# Altium project AdvancedSeq.PrjPcb
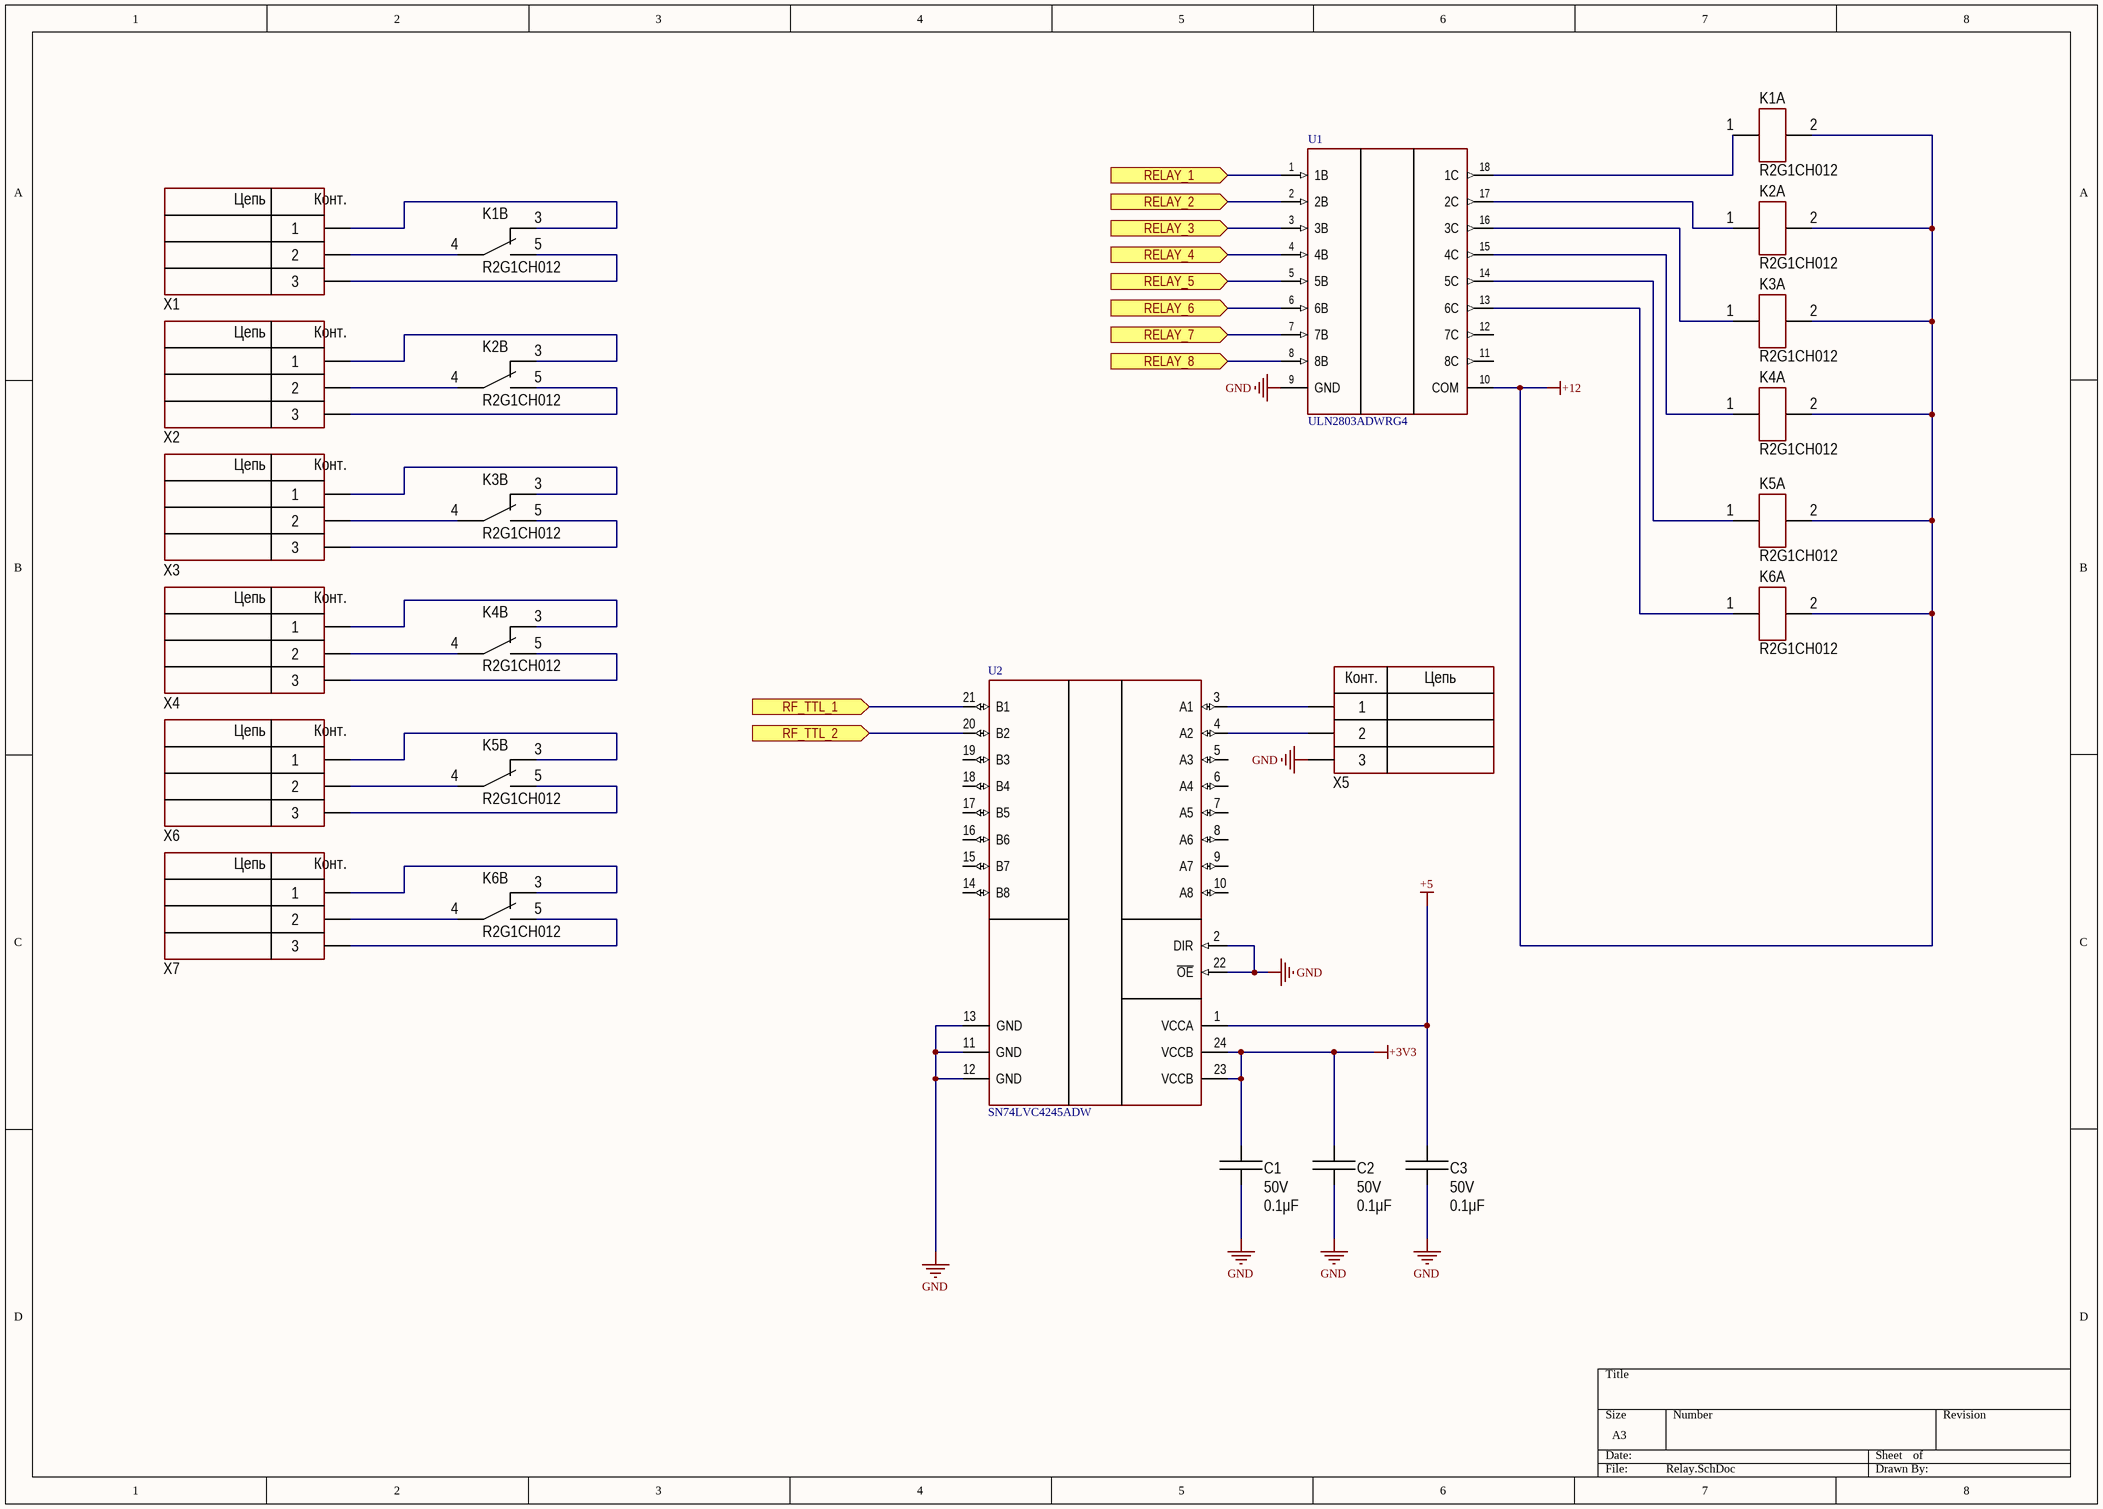
[diagram p0: Relay.SchDoc]
6 sheets, 93 parts. Net scope: flat (ports and power ports of the same name join across sheets).
Board file: Seq.PcbDoc
Sheets:
  Relay.SchDoc
  MCU.SchDoc
  Ext_PTT_and_Indication.SchDoc
  Power_Supply.SchDoc
  JTAG_Connector.SchDoc
  Shift_Regs.SchDoc

## Sheet Relay.SchDoc
size A3; SheetNumber: 1; SheetTotal: 2

### Parts
C1  value 0.1μF  Voltage: 50V  [CAP: 1206]
C2  value 0.1μF  Voltage: 50V  [CAP: 1206]
C3  value 0.1μF  Voltage: 50V  [CAP: 1206]
K1  (no value)  [R2G1CH012]  (parts A,B of 2)
K2  (no value)  [R2G1CH012]  (parts A,B of 2)
K3  (no value)  [R2G1CH012]  (parts A,B of 2)
K4  (no value)  [R2G1CH012]  (parts A,B of 2)
K5  (no value)  [R2G1CH012]  (parts A,B of 2)
K6  (no value)  [R2G1CH012]  (parts A,B of 2)
U1  ULN2803ADWRG4  [FP-DW0018A-MFG]
U2  SN74LVC4245ADW  [FP-DW0024A-MFG]
X1  (no value)  [2EDGR-5.08-03P]
X2  (no value)  [2EDGR-5.08-03P]
X3  (no value)  [2EDGR-5.08-03P]
X4  (no value)  [2EDGR-5.08-03P]
X5  (no value)  [2EDGR-5.08-03P]
X6  (no value)  [2EDGR-5.08-03P]
X7  (no value)  [2EDGR-5.08-03P]

### Ports
RELAY_1 (in), RELAY_2 (in), RELAY_3 (in), RELAY_4 (in), RELAY_5 (in), RELAY_6 (in), RELAY_7 (in), RELAY_8 (in), RF_TTL_1 (in), RF_TTL_2 (in)

### Nets
+3V3: C1.2 C2.2 U2.23(VCCB) U2.24(VCCB)
+5: C3.2 U2.1(VCCA)
+12: K1.2 K2.2 K3.2 K4.2 K5.2 K6.2 U1.10(COM)
GND: C1.1 C2.1 C3.1 U1.9(GND) U2.2(DIR) U2.11(GND) U2.12(GND) U2.22(~{OE}) X5.3
NetK1_1: K1.1 U1.18(1C)
NetK1_3: K1.3 X1.1
NetK1_4: K1.4 X1.2
NetK1_5: K1.5 X1.3
NetK2_1: K2.1 U1.17(2C)
NetK2_3: K2.3 X2.1
NetK2_4: K2.4 X2.2
NetK2_5: K2.5 X2.3
NetK3_1: K3.1 U1.16(3C)
NetK3_3: K3.3 X3.1
NetK3_4: K3.4 X3.2
NetK3_5: K3.5 X3.3
NetK4_1: K4.1 U1.15(4C)
NetK4_3: K4.3 X4.1
NetK4_4: K4.4 X4.2
NetK4_5: K4.5 X4.3
NetK5_1: K5.1 U1.14(5C)
NetK5_3: K5.3 X6.1
NetK5_4: K5.4 X6.2
NetK5_5: K5.5 X6.3
NetK6_1: K6.1 U1.13(6C)
NetK6_3: K6.3 X7.1
NetK6_4: K6.4 X7.2
NetK6_5: K6.5 X7.3
NetU1_1: U1.1(1B) ; port RELAY_1
NetU1_2: U1.2(2B) ; port RELAY_2
NetU1_3: U1.3(3B) ; port RELAY_3
NetU1_4: U1.4(4B) ; port RELAY_4
NetU1_5: U1.5(5B) ; port RELAY_5
NetU1_6: U1.6(6B) ; port RELAY_6
NetU1_7: U1.7(7B) ; port RELAY_7
NetU1_8: U1.8(8B) ; port RELAY_8
NetU2_3: U2.3(A1) X5.1
NetU2_4: U2.4(A2) X5.2
NetU2_20: U2.20(B2) ; port RF_TTL_2
NetU2_21: U2.21(B1) ; port RF_TTL_1

Not connected (* = marked no-connect by the designer): U1 11(8C) 12(7C); U2 5(A3) 6(A4) 7(A5) 8(A6) 9(A7) 10(A8) 13(GND) 14(B8) 15(B7) 16(B6) 17(B5) 18(B4) 19(B3)

### Notes on the sheet
- (in symbol 2EDGR-5.08-03P) Цепь; Конт.

### Library data of the parts
C1-C3 = Ceramic_1206: Manufacturer: Yageo; PartNumber: CC1206KRX7R9BB104; ValueManufacturerPartNumber: Ceramic capacitor, 0.1μF, X7R, ±10%, 50V, 1206, -55...+125°C; TypeCapacitor: Ceramic capacitor; Tolerance: ±10%; TypeDielectric: X7R; Package: 1206; HelpURL: https://www.digikey.com/product-detail/en/yageo/CC1206KRX7R9BB104/311-1179-1-ND/303089; Temperature: -55...+125°C
K1-K6 = R2G1CH012: Manufacturer: Omron; ValueManufacturerPartNumber: Electromechanics relay, 3VDC, 125VAC, 2A, 2NO+2NC, -40...+85°C; TypeRelay: Electromechanics relay; VoltageMax: 125VAC; VoltageControlCoil: 3VDC; MaxCurrent: 2A; Package: 2NO+2NC; HelpURL: https://www.digikey.com/product-detail/en/omron-electronics-inc-emc-div/G5V-2-DC3/Z2185-ND/369042; Temperature: -40...+85°C; PartNumber: R2G1CH012
U1 = CMP-04912-000023-1: TRANS 8NPN DARL 50V 0.5A 18SO; Manufacturer: Texas Instruments; Number Of Drivers: 8; Max Junction Temp: +150°C; Standoff Height: 0.1mm; Turn On Delay Time: 20ns; Nominal Supply Current: 0.93mA; Turn Off Delay Time: 130ns; Output Current: 500mA; Manufacturer Part Number: ULN2803ADWRG4; Mouser Description: Darlington Transistors TRANSISTOR ARRAYS; Temperature Range High: +85°C; Ipc Land Pattern Name: SOIC127P1030X265-18; RoHS: TRUE; ComponentLink2URL: http://www.ti.com/lit/ds/symlink/uln2803a.pdf; Device Class L2: Power Management ICs; Output Voltage: 50V; Digikey Description: TRANS 8NPN DARL 50V 0.5A 18SO; Package: DW0018A; Device Class L3: Gate Drivers; Octopart: https://octopart.com/uln2803adwrg4-texas+instruments-2343640; ComponentLink2Description: Datasheet; Ambient Temperature Range High: +85°C; Lead Free: Yes; Device Class L1: Integrated Circuits (ICs); Height: 2.65mm; Category: IC; Automotive: No; Temperature: -40°C to +85°C; Temperature Range Low: -40°C; Ambient Temperature Range Low: -40°C; Number Of Outputs: 8
U2 = CMP-04899-000091-1: IC TRNSLTR BIDIRECTIONAL 24SOIC; Number of Bits: 8; Low Level Output Current: 24mA; Output Type: Voltage; Propagation Delay: 9.8ns; Min Supply Voltage: 4.5V; Number of Elements: 1; Turn-On Delay Time: 6.7ns; Max Supply Current: 80uA; Max Supply Voltage: 5.5V; Polarity: Non-Inverting; Logic Function: Translator; Operating Supply Voltage: 5V; High Level Output Current: -24mA; Case/Package: SOIC; Height: 2.35mm; Width: 7.52mm; Number of Pins: 24; Weight: 0.022025oz; Lead Free: Lead Free; Packaging: Rail/Tube; Number of Channels: 8; Series: 74LVC; REACH SVHC: No SVHC; RoHS Compliant: Yes; Mount: Surface Mount; Length: 15.4mm; Package Quantity: 25; Radiation Hardening: No; Contact Plating: Gold; Quiescent Current: 80uA; Max Operating Temperature: 85°C; Direction: Bidirectional; Number of Outputs: 8; Technology: CMOS; Min Operating Temperature: -40°C; Number of Circuits: 8
X1-X7 = 2EDGR-5.08-03P: Manufacturer: Connfly; ValueManufacturerPartNumber: Connector, 6pin, 2.54mm, 500VAC, 3A; PartNumber: PBS-6; TypeConnector: Connector; VoltageMax: 500VAC; Pitch: 2.54mm; CurrentMax: 3A; Multichannel: 6pin; CommentText: "Разъем"; HelpURL: https://www.chipdip.ru/product/pbs-6

## Sheet MCU.SchDoc
size A2; SheetNumber: 2; SheetTotal: 2
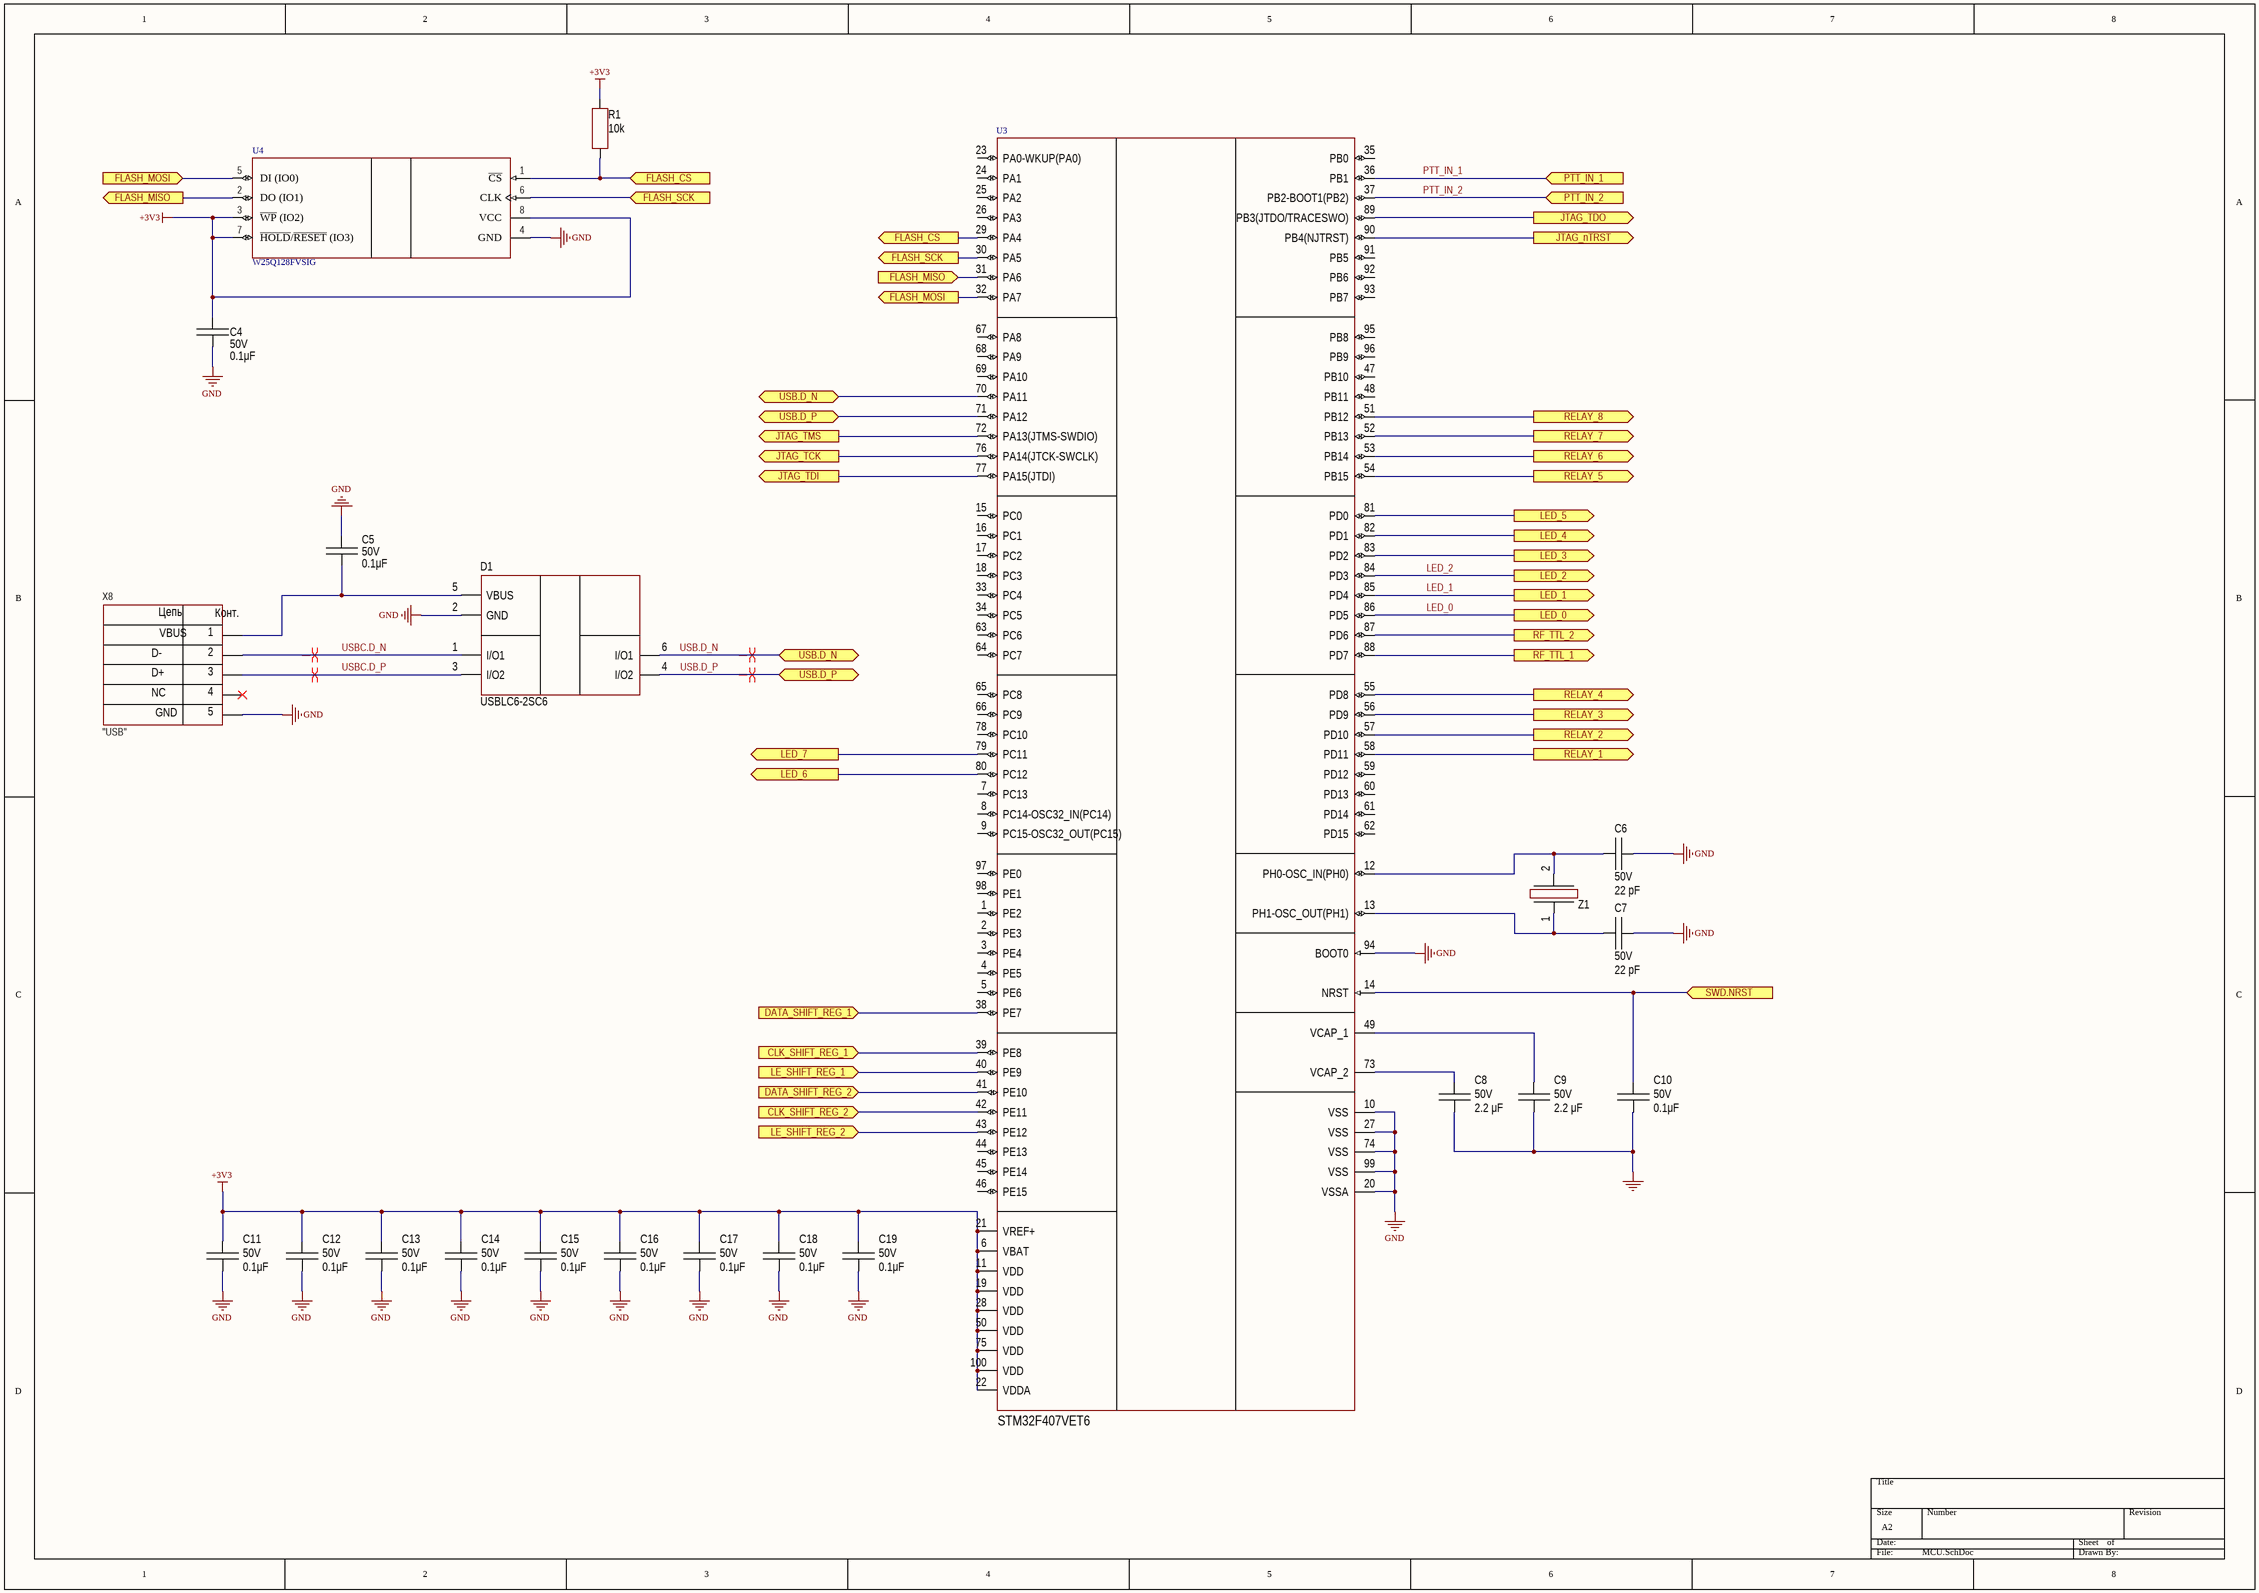
[diagram p1: MCU.SchDoc]

### Parts
C4  value 0.1μF  Voltage: 50V  [CAP: 1206]
C5  value 0.1μF  Voltage: 50V  [CAP: 1206]
C6  value 22 pF  Voltage: 50V  [CAP: 1206]
C7  value 22 pF  Voltage: 50V  [CAP: 1206]
C8  value 2.2 μF  Voltage: 50V  [CAP: 1206]
C9  value 2.2 μF  Voltage: 50V  [CAP: 1206]
C10  value 0.1μF  Voltage: 50V  [CAP: 1206]
C11  value 0.1μF  Voltage: 50V  [CAP: 1206]
C12  value 0.1μF  Voltage: 50V  [CAP: 1206]
C13  value 0.1μF  Voltage: 50V  [CAP: 1206]
C14  value 0.1μF  Voltage: 50V  [CAP: 1206]
C15  value 0.1μF  Voltage: 50V  [CAP: 1206]
C16  value 0.1μF  Voltage: 50V  [CAP: 1206]
C17  value 0.1μF  Voltage: 50V  [CAP: 1206]
C18  value 0.1μF  Voltage: 50V  [CAP: 1206]
C19  value 0.1μF  Voltage: 50V  [CAP: 1206]
D1  (no value)  [SOT23-6]
R1  value 10k  [RES: 1206]
U3  STM32F407VET6  [STM-LQFP100_V]
U4  W25Q128FVSIG  [8-SOIC]
X8  CommentText: "USB"  [CON: 0675031020]
Z1  (no value)  [CTS-ATS-SM-XTAL-2]

### Ports
CLK_SHIFT_REG_1 (in), CLK_SHIFT_REG_2 (in), DATA_SHIFT_REG_1 (in), DATA_SHIFT_REG_2 (in), FLASH_CS (in), FLASH_CS (out), FLASH_MISO (in), FLASH_MISO (out), FLASH_MOSI (in), FLASH_MOSI (out), FLASH_SCK (in), FLASH_SCK (out), JTAG_nTRST (out), JTAG_TCK (out), JTAG_TDI (out), JTAG_TDO (out), JTAG_TMS (out), LE_SHIFT_REG_1 (in), LE_SHIFT_REG_2 (in), LED_0 (out), LED_1 (out), LED_2 (out), LED_3 (out), LED_4 (out), LED_5 (out), LED_6 (out), LED_7 (out), PTT_IN_1 (in), PTT_IN_2 (in), RELAY_1 (out), RELAY_2 (out), RELAY_3 (out), RELAY_4 (out), RELAY_5 (out), RELAY_6 (out), RELAY_7 (out), RELAY_8 (out), RF_TTL_1 (out), RF_TTL_2 (out), SWD.NRST (in), USB.D_N (bidir), USB.D_P (bidir)

### Nets
+3V3: C4.1 C11.2 C12.2 C13.2 C14.2 C15.2 C16.2 C17.2 C18.2 C19.2 R1.1 U3.6(VBAT) U3.11(VDD) U3.19(VDD) U3.21(VREF+) U3.22(VDDA) U3.28(VDD) U3.50(VDD) U3.75(VDD) U3.100(VDD) U4.3(~{WP}_(IO2)) U4.7(~{HOLD}/~{RESET}_(IO3)) U4.8(VCC)
GND: C4.2 C5.1 C6.1 C7.1 C8.1 C9.1 C10.1 C11.1 C12.1 C13.1 C14.1 C15.1 C16.1 C17.1 C18.1 C19.1 D1.2(GND) U3.10(VSS) U3.20(VSSA) U3.27(VSS) U3.74(VSS) U3.94(BOOT0) U3.99(VSS) U4.4(GND) X8.5
JTAG_nTRST: U3.90(PB4(NJTRST)) ; port JTAG_nTRST
JTAG_TCK: U3.76(PA14(JTCK-SWCLK)) ; port JTAG_TCK
JTAG_TDI: U3.77(PA15(JTDI)) ; port JTAG_TDI
JTAG_TDO: U3.89(PB3(JTDO/TRACESWO)) ; port JTAG_TDO
JTAG_TMS: U3.72(PA13(JTMS-SWDIO)) ; port JTAG_TMS
LED_0: U3.86(PD5) ; port LED_0
LED_1: U3.85(PD4) ; port LED_1
LED_2: U3.84(PD3) ; port LED_2
PTT_IN_1: U3.36(PB1) ; port PTT_IN_1
PTT_IN_2: U3.37(PB2-BOOT1(PB2)) ; port PTT_IN_2
SWD.NRST: C10.2 U3.14(NRST) ; port SWD.NRST
USB.D_N: D1.6(I/O1) U3.70(PA11) ; port USB.D_N
USB.D_P: D1.4(I/O2) U3.71(PA12) ; port USB.D_P
USBC.D_N: D1.1(I/O1) X8.2
USBC.D_P: D1.3(I/O2) X8.3
NetC5_2: C5.2 D1.5(VBUS) X8.1
NetC6_2: C6.2 U3.12(PH0-OSC_IN(PH0)) Z1.2
NetC7_2: C7.2 U3.13(PH1-OSC_OUT(PH1)) Z1.1
NetC8_2: C8.2 U3.73(VCAP_2)
NetC9_2: C9.2 U3.49(VCAP_1)
NetR1_2: R1.2 U3.29(PA4) U4.1(~{CS}) ; port FLASH_CS
NetR9_1: U3.83(PD2) ; port LED_3
NetR10_1: U3.82(PD1) ; port LED_4
NetR11_1: U3.81(PD0) ; port LED_5
NetR12_1: U3.80(PC12) ; port LED_6
NetR13_1: U3.79(PC11) ; port LED_7
NetU1_1: U3.58(PD11) ; port RELAY_1
NetU1_2: U3.57(PD10) ; port RELAY_2
NetU1_3: U3.56(PD9) ; port RELAY_3
NetU1_4: U3.55(PD8) ; port RELAY_4
NetU1_5: U3.54(PB15) ; port RELAY_5
NetU1_6: U3.53(PB14) ; port RELAY_6
NetU1_7: U3.52(PB13) ; port RELAY_7
NetU1_8: U3.51(PB12) ; port RELAY_8
NetU2_20: U3.87(PD6) ; port RF_TTL_2
NetU2_21: U3.88(PD7) ; port RF_TTL_1
NetU3_30: U3.30(PA5) U4.6(CLK) ; port FLASH_SCK
NetU3_31: U3.31(PA6) U4.2(DO_(IO1)) ; port FLASH_MISO
NetU3_32: U3.32(PA7) U4.5(DI_(IO0)) ; port FLASH_MOSI
NetU3_38: U3.38(PE7) ; port DATA_SHIFT_REG_1
NetU3_39: U3.39(PE8) ; port CLK_SHIFT_REG_1
NetU3_40: U3.40(PE9) ; port LE_SHIFT_REG_1
NetU3_41: U3.41(PE10) ; port DATA_SHIFT_REG_2
NetU3_42: U3.42(PE11) ; port CLK_SHIFT_REG_2
NetU3_43: U3.43(PE12) ; port LE_SHIFT_REG_2

Not connected (* = marked no-connect by the designer): U3 1(PE2) 2(PE3) 3(PE4) 4(PE5) 5(PE6) 7(PC13) 8(PC14-OSC32_IN(PC14)) 9(PC15-OSC32_OUT(PC15)) 15(PC0) 16(PC1) 17(PC2) 18(PC3) 23(PA0-WKUP(PA0)) 24(PA1) 25(PA2) 26(PA3) 33(PC4) 34(PC5) 35(PB0) 44(PE13) 45(PE14) 46(PE15) 47(PB10) 48(PB11) 59(PD12) 60(PD13) 61(PD14) 62(PD15) 63(PC6) 64(PC7) 65(PC8) 66(PC9) 67(PA8) 68(PA9) 69(PA10) 78(PC10) 91(PB5) 92(PB6) 93(PB7) 95(PB8) 96(PB9) 97(PE0) 98(PE1); X8 4*

### Layout directives
differential pair: USB.D_N, USB.D_P, USBC.D_N, USBC.D_P

### Notes on the sheet
- (in symbol Connector_USB_mini_B) Цепь; Конт.; VBUS; D-; D+; NC; GND

### Library data of the parts
C4 C5 C10-C19 = Ceramic_1206: as C1 on sheet Relay; Package: 1206; HelpURL: https://www.digikey.com/product-detail/en/yageo/CC1206KRX7R9BB104/311-1179-1-ND/303089; Temperature: -55...+125°C
C6 C7 = Ceramic_1206: Manufacturer: Yageo; PartNumber: CC1206KRX7R9BB104; ValueManufacturerPartNumber: Ceramic capacitor, 22 pF, X7R, ±10%, 50V, 1206, -55...+125°C; TypeCapacitor: Ceramic capacitor; Tolerance: ±10%; TypeDielectric: X7R; Package: 1206; HelpURL: https://www.digikey.com/product-detail/en/yageo/CC1206KRX7R9BB104/311-1179-1-ND/303089; Temperature: -55...+125°C
C8 C9 = Ceramic_1206: Manufacturer: Yageo; PartNumber: CC1206KRX7R9BB104; ValueManufacturerPartNumber: Ceramic capacitor, 2.2 μF, X7R, ±10%, 50V, 1206, -55...+125°C; TypeCapacitor: Ceramic capacitor; Tolerance: ±10%; TypeDielectric: X7R; Package: 1206; HelpURL: https://www.digikey.com/product-detail/en/yageo/CC1206KRX7R9BB104/311-1179-1-ND/303089; Temperature: -55...+125°C
D1 = USBLC6-2SC6: Manufacturer: STMicroelectronics; TypeDiode: USB protection; Current: 5A peak; VoltageDrop: 17V; RecoveryTime: Power line; Package: SOT-23-6; HelpURL: https://www.digikey.com/product-detail/en/stmicroelectronics/USBLC6-2SC6/497-5235-1-ND/1121688; ValueManufacturerPartNumber: =TypeDiode+', '+Voltage+', '+Current+', '+VoltageDrop+', '+RecoveryTime+', '+Package+', '+Temperature; Temperature: -40...+125°C; PartNumber: USBLC6-2SC6
R1 = Resistor_1206: Manufacturer: Yageo; PartNumber: RC1206JR-07100RL; TypeResistor: Resistor film; Power: 0.25W; Package: 1206; HelpURL: https://www.digikey.com/product-detail/en/yageo/RC1206JR-07100RL/311-100ERCT-ND/732153; ValueManufacturerPartNumber: =TypeResistor+', '+Value+', '+Tolerance+', '+Package+', '+Power+', '+Temperature; Temperature: -55...+125°C
U3 = CMP-0243-00016-3: ARM Cortex-M4 32-bit MCU+FPU, 210 DMIPS, 512 kB Flash, 192 kB Internal RAM, 82 I/Os, 100-pin LQFP, -40 to 85 degC, Tray; Manufacturer: STMicroelectronics; Supply Voltage(Vcc) max (V): 3.6; Supply Voltage(Vcc) min (V): 1.8; I/Os (High Current): 82; FLASH Size (Prog) (kB): 512; Operating Frequency(F) (Processor speed) (MHz): 168; D/A Converter: 2x12-bit; Internal RAM Size (kB): 192; PackageReference: LQFP100; Core: ARM Cortex-M4; ComponentLink1URL: http://www.st.com/web/en/home.html; ComponentLink1Description: Manufacturer URL; DatasheetVersion: Rev. 4; Packing: Tray; Mounting Technology: Surface Mount; ComponentLink2Description: Datasheet; ComponentLink2URL: http://www.st.com/st-web-ui/static/active/en/resource/technical/document/datasheet/DM00037051.pdf; ComponentLink3Description: Package Specification; PartNumber: STM32F407VET6; PackageVersion: Rev. 1, 06/2013; PackageDescription: 100-Pin Low Profile Quad Flat Package, 14 x 14 mm Body, 0.5 mm Pitch; ComponentLink3URL: http://www.st.com/st-web-ui/static/active/en/resource/technical/document/data_brief/DM00071938.pdf
U4 = CMP-2000-05005-1: 3V 128M-Bit Serial Flash Memory with Dual/Quad SPI & QPI, 2.7 to 3.6 V, -40 to 85 degC, 8-Pin SOIC, RoHS, Tape and Reel; Manufacturer: Winbond; Number of Words: 16777216; Address Bus: 24b; Word Size: 8b; Boot Type: NotRequired; Supply Current: 20mA; Operating Supply Voltage (Max): 3.6V; Sync/Async: Synchronous; Rad Hardened: No; Interface Type: Serial(SPI); Access Time (Max): 7ns; Operating Supply Voltage (Min): 2.7V; Operating Supply Voltage (Typ): 3/3.3V; Programmable: Yes; Density: 134217728Bit; Cell Type: NOR; Package Description: 8-Pin Small Outline Integrated Circuit, Body 5.28 x 5.28 mm, Pitch 1.27 mm; Datasheet URL: http://download.siliconexpert.com/pdfs/2015/11/30/6/42/17/890/win_/manual/3w25q128fv20rev.l2008242015.pdf; Package Reference: SS-8; Package Type: SOICW; Datasheet Version: Rev. L, 08/2015; Manufacturer URL: http://www.winbond.com/hq/index.html?__locale=en; Pin Count: 8; Operating Temperature Classification: Industrial; Operating Temperature (Min): -40C; Program/Erase Volt (Typ): 2.7to3.6V; Operating Temperature (Max): 85C; Mounting: SurfaceMount; Operating Temp Range: -40Cto85C
X8 = Connector_USB_mini_B: Manufacturer: Molex; ValueManufacturerPartNumber: USB mini B; PartNumber: 0675031020; HelpURL: https://www.digikey.com/product-detail/en/molex/0675031020/WM5461CT-ND/1624427; TypeConnector: USB mini B
Z1 = Crystal_3215: Manufacturer: Epson; PartNumber: FC-135 32.7680KA-A5; LoadCapacitance: 12.5pF; Tolerance: ±20ppm; Package: case 3215; HelpURL: https://www.digikey.com/product-detail/en/epson/FC-135-32.7680KA-A5/SER4103CT-ND/6188447; ValueManufacturerPartNumber: =TypeOscilator+', '+Frequency+', '+LoadCapacitance+', '+Tolerance+', '+Package+', '+Temperature; Temperature: -40...+85°C; TypeOscilator: Crystal

## Sheet Ext_PTT_and_Indication.SchDoc
size A3
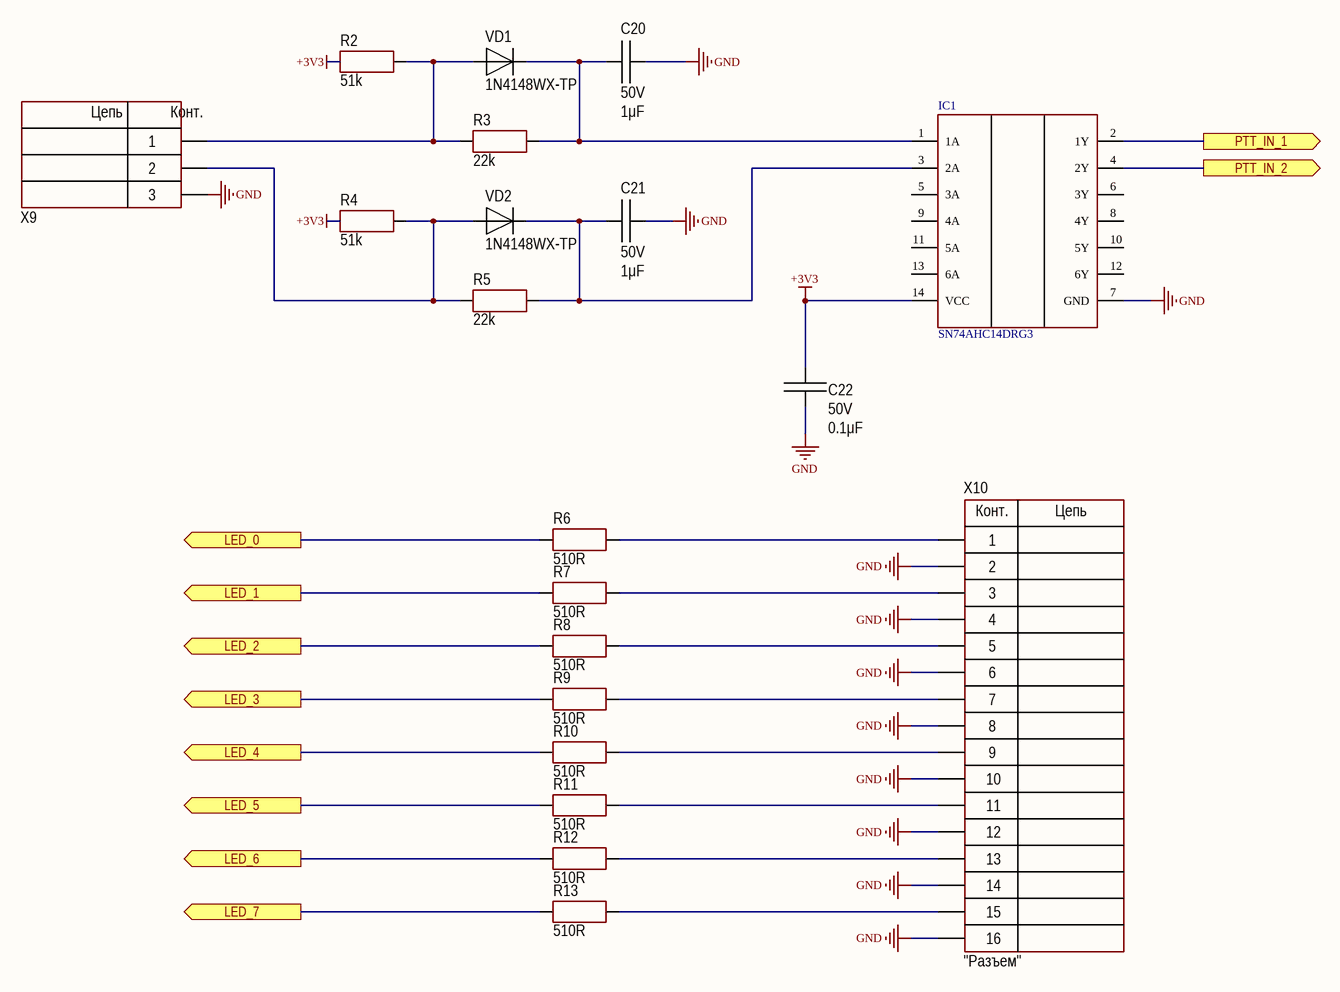
[diagram p2: Ext_PTT_and_Indication.SchDoc]

### Parts
C20  value 1μF  Voltage: 50V  [CAP: 1206]
C21  value 1μF  Voltage: 50V  [CAP: 1206]
C22  value 0.1μF  Voltage: 50V  [CAP: 1206]
IC1  SN74AHC14DRG3  [D0014A_N]
R2  value 51k  [RES: 1206]
R3  value 22k  [RES: 1206]
R4  value 51k  [RES: 1206]
R5  value 22k  [RES: 1206]
R6  value 510R  [RES: 1206]
R7  value 510R  [RES: 1206]
R8  value 510R  [RES: 1206]
R9  value 510R  [RES: 1206]
R10  value 510R  [RES: 1206]
R11  value 510R  [RES: 1206]
R12  value 510R  [RES: 1206]
R13  value 510R  [RES: 1206]
VD1  PartNumber: 1N4148WX-TP  [DIODE: SOD123]
VD2  PartNumber: 1N4148WX-TP  [DIODE: SOD123]
X9  (no value)  [2EDGR-5.08-03P]
X10  CommentText: "Разъем"  [CON: IDC-16MS]

### Ports
LED_0 (out), LED_1 (out), LED_2 (out), LED_3 (out), LED_4 (out), LED_5 (out), LED_6 (out), LED_7 (out), PTT_IN_1 (out), PTT_IN_2 (out)

### Nets
+3V3: C22.2 IC1.14(VCC) R2.2 R4.2
GND: C20.1 C21.1 C22.1 IC1.7(GND) X9.3 X10.2 X10.4 X10.6 X10.8 X10.10 X10.12 X10.14 X10.16
LED_0: R6.1 ; port LED_0
LED_1: R7.1 ; port LED_1
LED_2: R8.1 ; port LED_2
PTT_IN_1: IC1.2(1Y) ; port PTT_IN_1
PTT_IN_2: IC1.4(2Y) ; port PTT_IN_2
NetC20_2: C20.2 IC1.1(1A) R3.1 VD1.2
NetC21_2: C21.2 IC1.3(2A) R5.1 VD2.2
NetR2_1: R2.1 R3.2 VD1.1 X9.1
NetR4_1: R4.1 R5.2 VD2.1 X9.2
NetR6_2: R6.2 X10.1
NetR7_2: R7.2 X10.3
NetR8_2: R8.2 X10.5
NetR9_1: R9.1 ; port LED_3
NetR9_2: R9.2 X10.7
NetR10_1: R10.1 ; port LED_4
NetR10_2: R10.2 X10.9
NetR11_1: R11.1 ; port LED_5
NetR11_2: R11.2 X10.11
NetR12_1: R12.1 ; port LED_6
NetR12_2: R12.2 X10.13
NetR13_1: R13.1 ; port LED_7
NetR13_2: R13.2 X10.15

Not connected (* = marked no-connect by the designer): IC1 5(3A) 6(3Y) 8(4Y) 9(4A) 10(5Y) 11(5A) 12(6Y) 13(6A)

### Notes on the sheet
- (in symbol 2EDGR-5.08-03P) Цепь; Конт.
- (in symbol IDC-16) Конт.; Цепь

### Library data of the parts
C20 C21 = Ceramic_1206: Manufacturer: Yageo; PartNumber: CC1206KRX7R9BB104; ValueManufacturerPartNumber: Ceramic capacitor, 1μF, X7R, ±10%, 50V, 1206, -55...+125°C; TypeCapacitor: Ceramic capacitor; Tolerance: ±10%; TypeDielectric: X7R; Package: 1206; HelpURL: https://www.digikey.com/product-detail/en/yageo/CC1206KRX7R9BB104/311-1179-1-ND/303089; Temperature: -55...+125°C
C22 = Ceramic_1206: as C1 on sheet Relay; Package: 1206; HelpURL: https://www.digikey.com/product-detail/en/yageo/CC1206KRX7R9BB104/311-1179-1-ND/303089; Temperature: -55...+125°C
IC1 = SN74AHC14DRG3: Integrated Circuit; Manufacturer_Name: Nexperia; Manufacturer_Part_Number: 74HC14N,652; Arrow Part Number: 74HC14N,652; Arrow Price/Stock: https://www.arrow.com/en/products/74hc14n652/nexperia
R2-R13 = Resistor_1206: as R1 on sheet MCU; Package: 1206; HelpURL: https://www.digikey.com/product-detail/en/yageo/RC1206JR-07100RL/311-100ERCT-ND/732153; ValueManufacturerPartNumber: =TypeResistor+', '+Value+', '+Tolerance+', '+Package+', '+Power+', '+Temperature; Temperature: -55...+125°C
VD1 VD2 = Diode_single: Manufacturer: Micro Commercial; ValueManufacturerPartNumber: Single diode, 75V, 150mA, 1V, 4ns, SOD-323, -55...+150°C; TypeDiode: Single diode; Voltage: 75V; Current: 150mA; VoltageDrop: 1V; RecoveryTime: 4ns; Package: SOD-323; HelpURL: https://www.digikey.com/product-detail/en/micro-commercial-co/1N4148WX-TP/1N4148WXTPMSCT-ND/717312; Temperature: -55...+150°C
X9 = 2EDGR-5.08-03P: as X1 on sheet Relay; HelpURL: https://www.chipdip.ru/product/pbs-6
X10 = IDC-16: Manufacturer: Connfly; ValueManufacturerPartNumber: Connector, 16pin, 2.54mm, 250VAC, 3A; TypeConnector: Connector; VoltageMax: 250VAC; Pitch: 2.54mm; CurrentMax: 3A; Multichannel: 16pin; HelpURL: https://www.chipdip.ru/product/idc-16ms; PartNumber: IDC-16

## Sheet Power_Supply.SchDoc
size A3
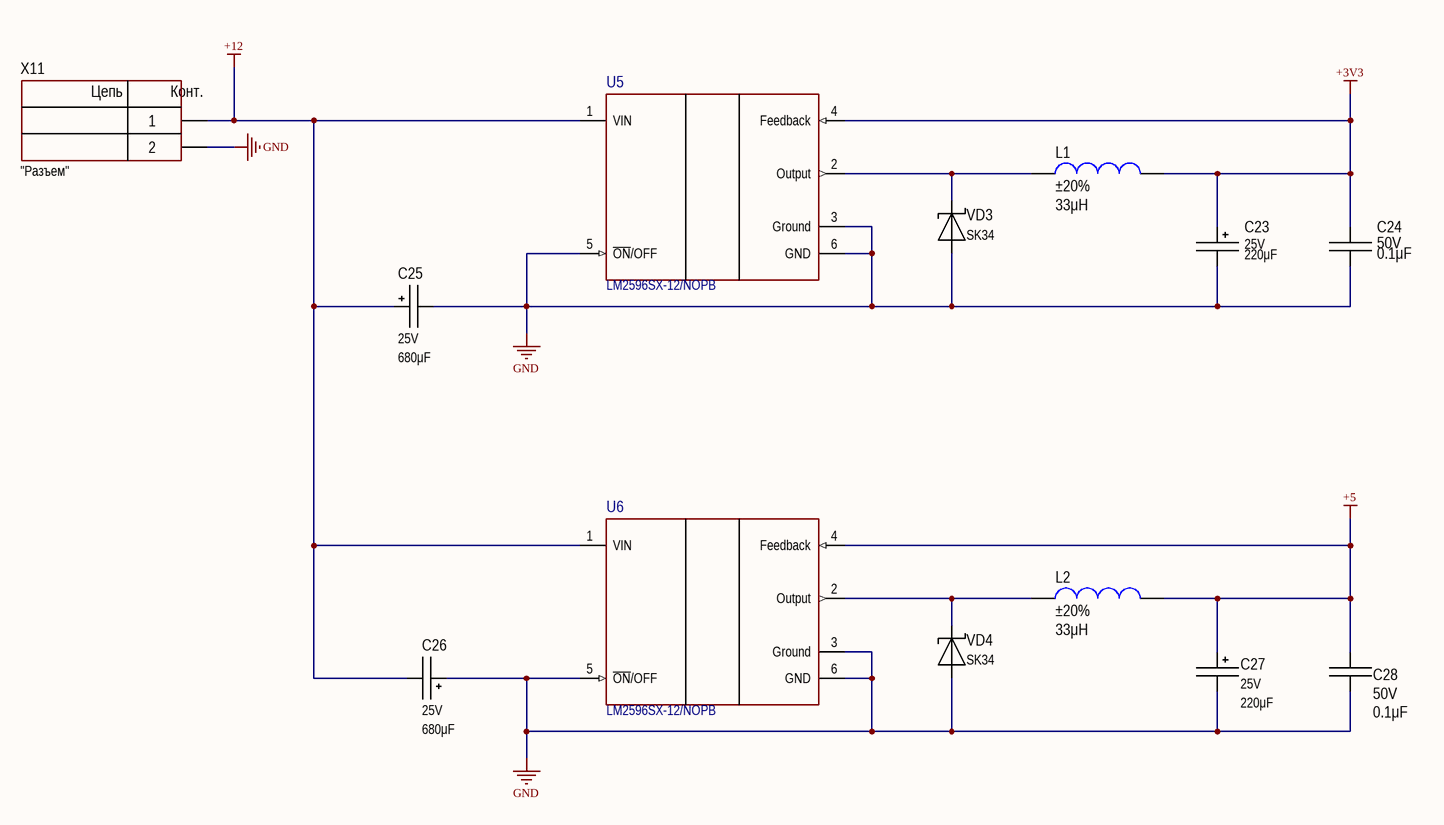
[diagram p3: Power_Supply.SchDoc]

### Parts
C23  value 220μF  Voltage: 25V  [CAP: D10C5H16]
C24  value 0.1μF  Voltage: 50V  [CAP: 1206]
C25  value 680μF  Voltage: 25V  [CAP: D10C5H16]
C26  value 680μF  Voltage: 25V  [CAP: D10C5H16]
C27  value 220μF  Voltage: 25V  [CAP: D10C5H16]
C28  value 0.1μF  Voltage: 50V  [CAP: 1206]
L1  value 33μH  Tolerance: ±20%  [SRR1208-101YL]
L2  value 33μH  Tolerance: ±20%  [SRR1208-101YL]
U5  LM2596SX-12/NOPB  [FP-KTT0005B-MFG]
U6  LM2596SX-12/NOPB  [FP-KTT0005B-MFG]
VD3  PartNumber: SK34  [DIODE: SMC]
VD4  PartNumber: SK34  [DIODE: SMC]
X11  CommentText: "Разъем"  [CON: DG350-3.5-02P]

### Nets
+3V3: C23.1 C24.2 L1.1 U5.4(Feedback)
+5: C27.1 C28.2 L2.1 U6.4(Feedback)
+12: C25.1 C26.2 U5.1(VIN) U6.1(VIN) X11.1
GND: C23.2 C24.1 C25.2 C26.1 C27.2 C28.1 U5.3(Ground) U5.5(~{ON}/OFF) U5.6(GND) U6.3(Ground) U6.5(~{ON}/OFF) U6.6(GND) VD3.1 VD4.1 X11.2
NetL1_2: L1.2 U5.2(Output) VD3.2
NetL2_2: L2.2 U6.2(Output) VD4.2

### Notes on the sheet
- (in symbol Connector_terminal_2pin) Цепь; Конт.

### Library data of the parts
C23 C27 = Aluminium: Manufacturer: Wurth; PartNumber: 860080475013; ValueManufacturerPartNumber: Aluminium capacitor, 220μF, 25V, ±20%, 54mOhm, 14x10x5 mm, -55...+105°C; TypeCapacitor: Aluminium capacitor; Tolerance: ±20%; Impedance: 54mOhm; Package: 14x10x5 mm; HelpURL: https://www.digikey.com/product-detail/en/wurth-electronics-inc/860080475013/732-9029-1-ND/5728972; Temperature: -55...+105°C
C24 C28 = Ceramic_1206: as C1 on sheet Relay; Package: 1206; HelpURL: https://www.digikey.com/product-detail/en/yageo/CC1206KRX7R9BB104/311-1179-1-ND/303089; Temperature: -55...+125°C
C25 C26 = Aluminium: Manufacturer: Wurth; PartNumber: 860080475013; ValueManufacturerPartNumber: Aluminium capacitor, 680μF, 25V, ±20%, 54mOhm, 14x10x5 mm, -55...+105°C; TypeCapacitor: Aluminium capacitor; Tolerance: ±20%; Impedance: 54mOhm; Package: 14x10x5 mm; HelpURL: https://www.digikey.com/product-detail/en/wurth-electronics-inc/860080475013/732-9029-1-ND/5728972; Temperature: -55...+105°C
L1 L2 = Inductor_SDR0403: Manufacturer: Bourns; PartNumber: SDR0403-4R7ML; ValueManufacturerPartNumber: Fixed inductor, 33μH, ±20%, SDR0403, 1.7A, -40...+125°C; TypeInductor: Fixed inductor; MaxCurrent: 1.7A; Package: SDR0403; HelpURL: https://www.digikey.com/product-detail/en/bourns-inc/SDR0403-4R7ML/SDR0403-4R7MLCT-ND/2127096; Temperature: -40...+125°C
U5 U6 = CMP-04918-000013-1: IC REG BUCK 12V 3A TO263-5; Manufacturer: Texas Instruments; Max Duty Cycle: 100%; Max Junction Temp: +150°C; Min Supply Voltage: 4.5V; Max Supply Voltage: 40V; Standoff Height: 0mm; Switching Frequency: 150kHz; Nominal Supply Current: 5mA; Number Of Outputs: 1; Output Type: Fixed; Device Class L1: Integrated Circuits (ICs); ComponentLink2Description: Datasheet; Height: 4.8mm; Switching Topology: Buck; Device Class L2: Power Management ICs; Temperature Range Low: -40°C; Output Voltage: 12V; Lead Free: Yes; Digikey Description: IC REG BUCK 12V 3A TO263-5; Device Class L3: Voltage Regulators - Switching; Manufacturer Part Number: LM2596SX-12/NOPB; Octopart: https://octopart.com/lm2596sx-12%2Fnopb-texas+instruments-24812942; Mouser Description: SIMPLE SWITCHER® 4.5V to 40V, 3A Low Component Count Step-Down Regulator 5-DDPAK/TO-263; Package: KTT0005B; Output Current: 3A; Automotive: No; Temperature: -40°C to +125°C; RoHS: TRUE; Temperature Range High: +125°C; Category: IC; ComponentLink2URL: http://www.ti.com/lit/ds/symlink/lm2596.pdf
VD3 VD4 = Schottky_single: Manufacturer: Diodes Incorporated; ValueManufacturerPartNumber: Schottky diode, 80V, 500mA, 1V, 15pF, SOD-123, -55...+150°C; TypeDiode: Schottky diode; Voltage: 80V; Current: 500mA; VoltageDrop: 1V; RecoveryTime: 15pF; Package: SOD-123; HelpURL: https://www.digikey.com/product-detail/en/diodes-incorporated/MBR0580S1-7/MBR0580S1-7DICT-ND/5080371; Temperature: -55...+150°C
X11 = Connector_terminal_2pin: Manufacturer: Degson; ValueManufacturerPartNumber: Terminal connector, 2pin, 3.5mm, 300VAC, 10A; PartNumber: DG350-3.5-02P-14; TypeConnector: Terminal connector; VoltageMax: 300VAC; Pitch: 3.5mm; CurrentMax: 10A; Multichannel: 2pin; HelpURL: https://www.chipdip.ru/product/dg350-3.5-02p-12

## Sheet JTAG_Connector.SchDoc
size A3
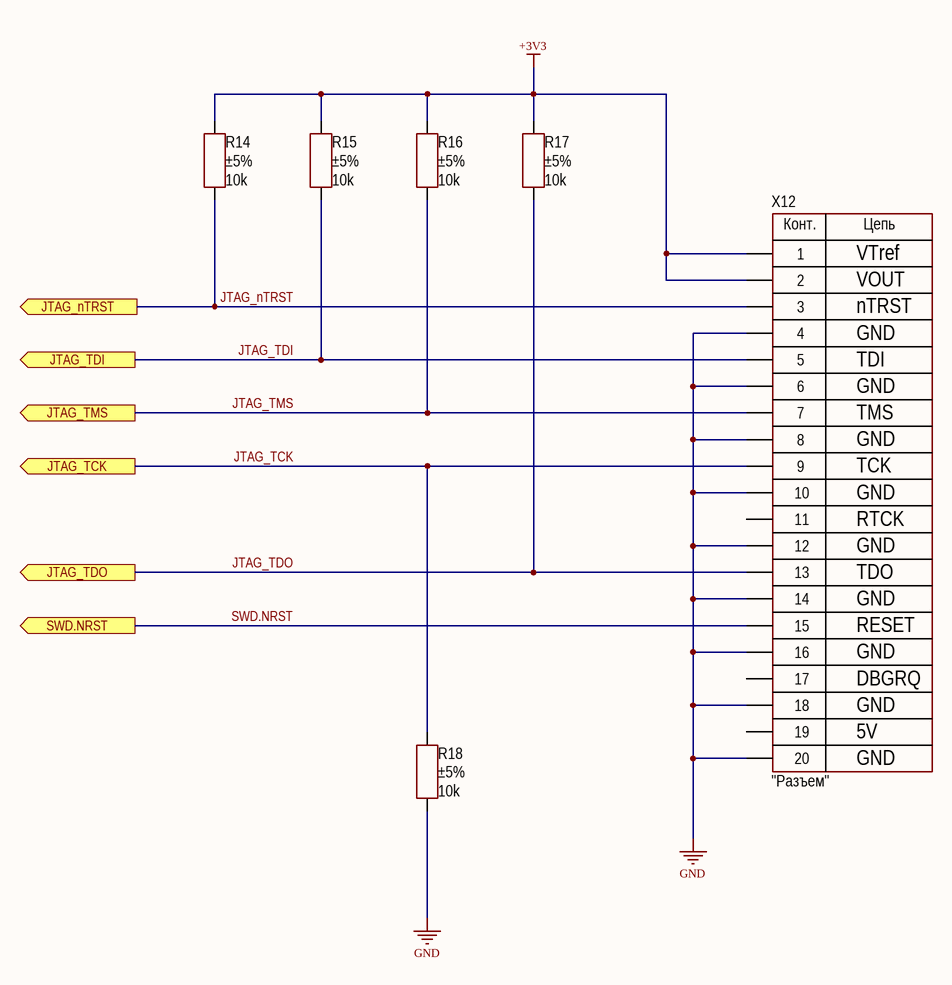
[diagram p4: JTAG_Connector.SchDoc]

### Parts
R14  value 10k  Tolerance: ±5%  [RES: 1206]
R15  value 10k  Tolerance: ±5%  [RES: 1206]
R16  value 10k  Tolerance: ±5%  [RES: 1206]
R17  value 10k  Tolerance: ±5%  [RES: 1206]
R18  value 10k  Tolerance: ±5%  [RES: 1206]
X12  CommentText: "Разъем"  [CON: IDC-20MS]

### Ports
JTAG_nTRST (out), JTAG_TCK (out), JTAG_TDI (out), JTAG_TDO (out), JTAG_TMS (out), SWD.NRST (out)

### Nets
+3V3: R14.2 R15.2 R16.2 R17.2 X12.1 X12.2
GND: R18.1 X12.4 X12.6 X12.8 X12.10 X12.12 X12.14 X12.16 X12.18 X12.20
JTAG_nTRST: R14.1 X12.3 ; port JTAG_nTRST
JTAG_TCK: R18.2 X12.9 ; port JTAG_TCK
JTAG_TDI: R15.1 X12.5 ; port JTAG_TDI
JTAG_TDO: R17.1 X12.13 ; port JTAG_TDO
JTAG_TMS: R16.1 X12.7 ; port JTAG_TMS
SWD.NRST: X12.15 ; port SWD.NRST

Not connected (* = marked no-connect by the designer): X12 11 17 19

### Notes on the sheet
- VTref
- VOUT
- nTRST
- GND
- TDI
- TMS
- TCK
- RTCK
- TDO
- RESET
- DBGRQ
- 5V
- (in symbol IDC-20) Конт.; Цепь

### Library data of the parts
R14-R18 = Resistor_1206: Manufacturer: Yageo; PartNumber: RC1206JR-07100RL; ValueManufacturerPartNumber: Resistor film, 10k, ±5%, 1206, 0.25W, -55...+125°C; TypeResistor: Resistor film; Power: 0.25W; Package: 1206; HelpURL: https://www.digikey.com/product-detail/en/yageo/RC1206JR-07100RL/311-100ERCT-ND/732153; Temperature: -55...+125°C
X12 = IDC-20: Manufacturer: Connfly; ValueManufacturerPartNumber: Connector, 20pin, 2.54mm, 250VAC, 3A; TypeConnector: Connector; VoltageMax: 250VAC; Pitch: 2.54mm; CurrentMax: 3A; Multichannel: 20pin; HelpURL: https://www.chipdip.ru/product/idc-20ms; PartNumber: IDC-20

## Sheet Shift_Regs.SchDoc
size A3
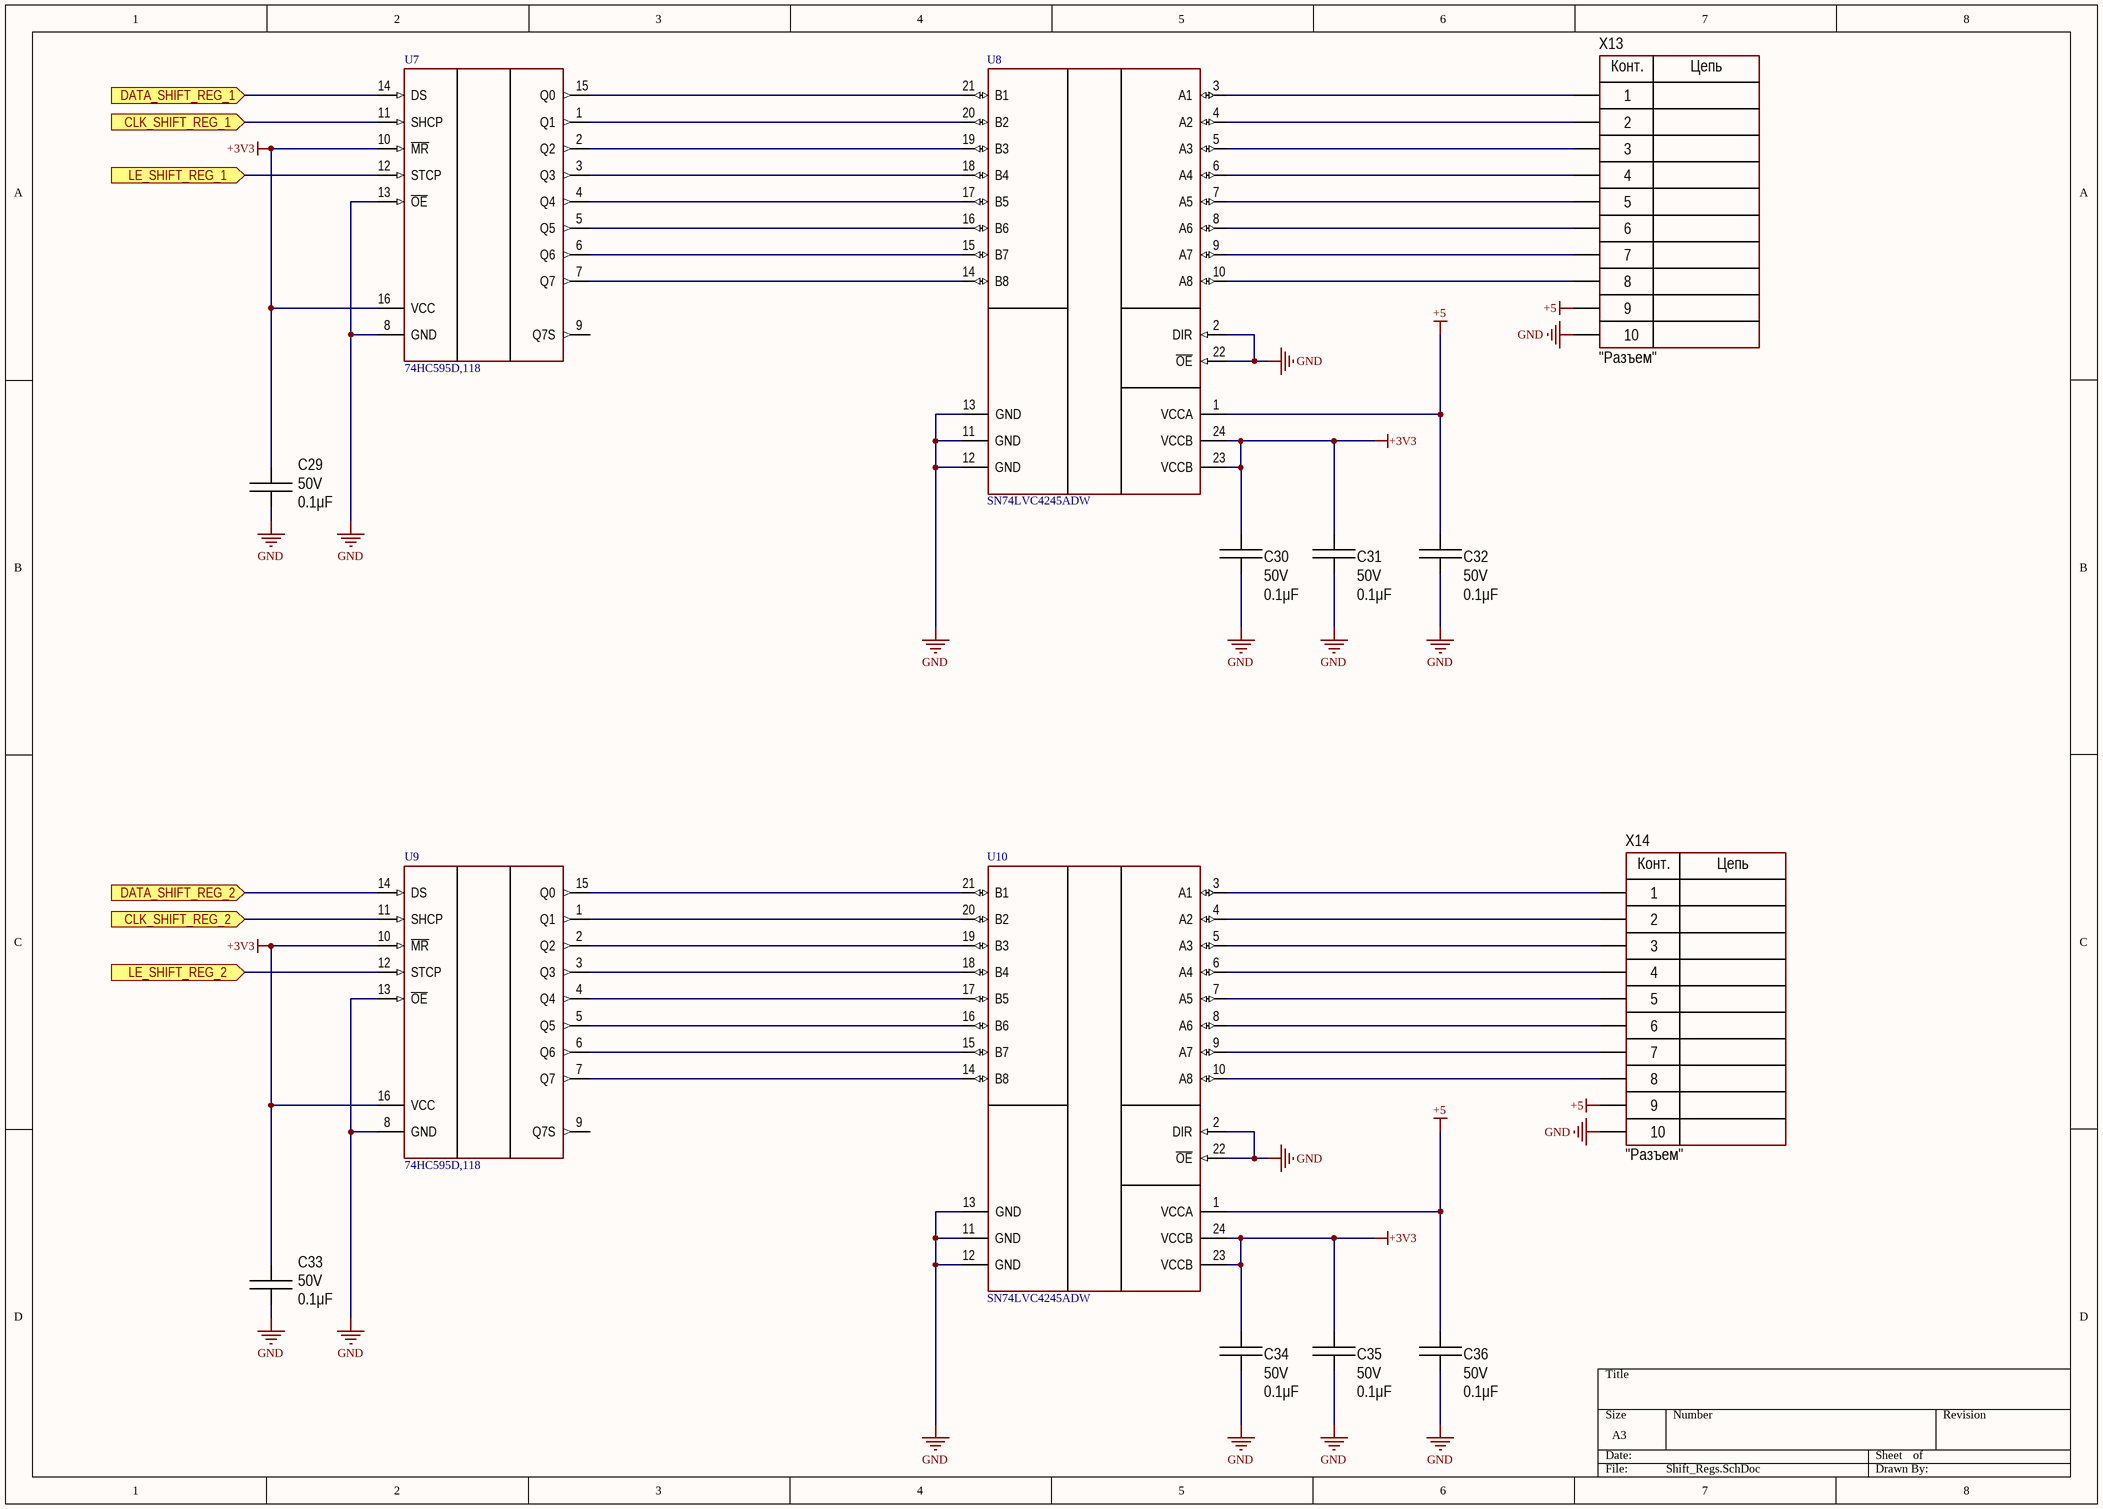
[diagram p5: Shift_Regs.SchDoc]

### Parts
C29  value 0.1μF  Voltage: 50V  [CAP: 1206]
C30  value 0.1μF  Voltage: 50V  [CAP: 1206]
C31  value 0.1μF  Voltage: 50V  [CAP: 1206]
C32  value 0.1μF  Voltage: 50V  [CAP: 1206]
C33  value 0.1μF  Voltage: 50V  [CAP: 1206]
C34  value 0.1μF  Voltage: 50V  [CAP: 1206]
C35  value 0.1μF  Voltage: 50V  [CAP: 1206]
C36  value 0.1μF  Voltage: 50V  [CAP: 1206]
U7  74HC595D,118  [FP-SOT109-1-MFG]
U8  SN74LVC4245ADW  [FP-DW0024A-MFG]
U9  74HC595D,118  [FP-SOT109-1-MFG]
U10  SN74LVC4245ADW  [FP-DW0024A-MFG]
X13  CommentText: "Разъем"  [CON: IDC-10MS]
X14  CommentText: "Разъем"  [CON: IDC-10MS]

### Ports
CLK_SHIFT_REG_1 (in), CLK_SHIFT_REG_2 (in), DATA_SHIFT_REG_1 (in), DATA_SHIFT_REG_2 (in), LE_SHIFT_REG_1 (in), LE_SHIFT_REG_2 (in)

### Nets
+3V3: C29.2 C30.2 C31.2 C33.2 C34.2 C35.2 U7.10(~{MR}) U7.16(VCC) U8.23(VCCB) U8.24(VCCB) U9.10(~{MR}) U9.16(VCC) U10.23(VCCB) U10.24(VCCB)
+5: C32.2 C36.2 U8.1(VCCA) U10.1(VCCA) X13.9 X14.9
GND: C29.1 C30.1 C31.1 C32.1 C33.1 C34.1 C35.1 C36.1 U7.8(GND) U7.13(~{OE}) U8.2(DIR) U8.11(GND) U8.12(GND) U8.13(GND) U8.22(~{OE}) U9.8(GND) U9.13(~{OE}) U10.2(DIR) U10.11(GND) U10.12(GND) U10.13(GND) U10.22(~{OE}) X13.10 X14.10
NetU3_38: U7.14(DS) ; port DATA_SHIFT_REG_1
NetU3_39: U7.11(SHCP) ; port CLK_SHIFT_REG_1
NetU3_40: U7.12(STCP) ; port LE_SHIFT_REG_1
NetU3_41: U9.14(DS) ; port DATA_SHIFT_REG_2
NetU3_42: U9.11(SHCP) ; port CLK_SHIFT_REG_2
NetU3_43: U9.12(STCP) ; port LE_SHIFT_REG_2
NetU7_1: U7.1(Q1) U8.20(B2)
NetU7_2: U7.2(Q2) U8.19(B3)
NetU7_3: U7.3(Q3) U8.18(B4)
NetU7_4: U7.4(Q4) U8.17(B5)
NetU7_5: U7.5(Q5) U8.16(B6)
NetU7_6: U7.6(Q6) U8.15(B7)
NetU7_7: U7.7(Q7) U8.14(B8)
NetU7_15: U7.15(Q0) U8.21(B1)
NetU8_3: U8.3(A1) X13.1
NetU8_4: U8.4(A2) X13.2
NetU8_5: U8.5(A3) X13.3
NetU8_6: U8.6(A4) X13.4
NetU8_7: U8.7(A5) X13.5
NetU8_8: U8.8(A6) X13.6
NetU8_9: U8.9(A7) X13.7
NetU8_10: U8.10(A8) X13.8
NetU9_1: U9.1(Q1) U10.20(B2)
NetU9_2: U9.2(Q2) U10.19(B3)
NetU9_3: U9.3(Q3) U10.18(B4)
NetU9_4: U9.4(Q4) U10.17(B5)
NetU9_5: U9.5(Q5) U10.16(B6)
NetU9_6: U9.6(Q6) U10.15(B7)
NetU9_7: U9.7(Q7) U10.14(B8)
NetU9_15: U9.15(Q0) U10.21(B1)
NetU10_3: U10.3(A1) X14.1
NetU10_4: U10.4(A2) X14.2
NetU10_5: U10.5(A3) X14.3
NetU10_6: U10.6(A4) X14.4
NetU10_7: U10.7(A5) X14.5
NetU10_8: U10.8(A6) X14.6
NetU10_9: U10.9(A7) X14.7
NetU10_10: U10.10(A8) X14.8

Not connected (* = marked no-connect by the designer): U7 9(Q7S); U9 9(Q7S)

### Notes on the sheet
- (in symbol IDC-10) Конт.; Цепь

### Library data of the parts
C29-C36 = Ceramic_1206: as C1 on sheet Relay; Package: 1206; HelpURL: https://www.digikey.com/product-detail/en/yageo/CC1206KRX7R9BB104/311-1179-1-ND/303089; Temperature: -55...+125°C
U7 U9 = CMP-14351-000006-1: IC SHIFT REGISTER 8BIT 16SOIC; RoHS Compliant: Yes
U8 U10 = CMP-04899-000091-1: as U2 on sheet Relay; Case/Package: SOIC; Height: 2.35mm; Width: 7.52mm; Number of Pins: 24; Weight: 0.022025oz; Lead Free: Lead Free; Packaging: Rail/Tube; Number of Channels: 8; Series: 74LVC; REACH SVHC: No SVHC; RoHS Compliant: Yes; Mount: Surface Mount; Length: 15.4mm; Package Quantity: 25; Radiation Hardening: No; Contact Plating: Gold; Quiescent Current: 80uA; Max Operating Temperature: 85°C; Direction: Bidirectional; Number of Outputs: 8; Technology: CMOS; Min Operating Temperature: -40°C; Number of Circuits: 8
X13 X14 = IDC-10: Manufacturer: Connfly; ValueManufacturerPartNumber: Connector, 10pin, 2.54mm, 250VAC, 3A; TypeConnector: Connector; VoltageMax: 250VAC; Pitch: 2.54mm; CurrentMax: 3A; Multichannel: 10pin; HelpURL: https://www.chipdip.ru/product/idc-10ms; PartNumber: IDC-10

## Nets that join several sheets
+3V3: Relay (C1.2 C2.2 U2.23 U2.24), MCU (23 pins), Ext_PTT_and_Indication (C22.2 IC1.14 R2.2 R4.2), Power_Supply (C23.1 C24.2 L1.1 U5.4), JTAG_Connector (6 pins), Shift_Regs (14 pins)
+5: Relay (C3.2 U2.1), Power_Supply (C27.1 C28.2 L2.1 U6.4), Shift_Regs (6 pins)
+12: Relay (7 pins), Power_Supply (5 pins)
GND: Relay (9 pins), MCU (25 pins), Ext_PTT_and_Indication (13 pins), Power_Supply (15 pins), JTAG_Connector (10 pins), Shift_Regs (24 pins)
JTAG_nTRST: MCU (U3.90), JTAG_Connector (R14.1 X12.3)
JTAG_TCK: MCU (U3.76), JTAG_Connector (R18.2 X12.9)
JTAG_TDI: MCU (U3.77), JTAG_Connector (R15.1 X12.5)
JTAG_TDO: MCU (U3.89), JTAG_Connector (R17.1 X12.13)
JTAG_TMS: MCU (U3.72), JTAG_Connector (R16.1 X12.7)
LED_0: MCU (U3.86), Ext_PTT_and_Indication (R6.1)
LED_1: MCU (U3.85), Ext_PTT_and_Indication (R7.1)
LED_2: MCU (U3.84), Ext_PTT_and_Indication (R8.1)
NetR9_1: MCU (U3.83), Ext_PTT_and_Indication (R9.1)
NetR10_1: MCU (U3.82), Ext_PTT_and_Indication (R10.1)
NetR11_1: MCU (U3.81), Ext_PTT_and_Indication (R11.1)
NetR12_1: MCU (U3.80), Ext_PTT_and_Indication (R12.1)
NetR13_1: MCU (U3.79), Ext_PTT_and_Indication (R13.1)
NetU1_1: Relay (U1.1), MCU (U3.58)
NetU1_2: Relay (U1.2), MCU (U3.57)
NetU1_3: Relay (U1.3), MCU (U3.56)
NetU1_4: Relay (U1.4), MCU (U3.55)
NetU1_5: Relay (U1.5), MCU (U3.54)
NetU1_6: Relay (U1.6), MCU (U3.53)
NetU1_7: Relay (U1.7), MCU (U3.52)
NetU1_8: Relay (U1.8), MCU (U3.51)
NetU2_20: Relay (U2.20), MCU (U3.87)
NetU2_21: Relay (U2.21), MCU (U3.88)
NetU3_38: MCU (U3.38), Shift_Regs (U7.14)
NetU3_39: MCU (U3.39), Shift_Regs (U7.11)
NetU3_40: MCU (U3.40), Shift_Regs (U7.12)
NetU3_41: MCU (U3.41), Shift_Regs (U9.14)
NetU3_42: MCU (U3.42), Shift_Regs (U9.11)
NetU3_43: MCU (U3.43), Shift_Regs (U9.12)
PTT_IN_1: MCU (U3.36), Ext_PTT_and_Indication (IC1.2)
PTT_IN_2: MCU (U3.37), Ext_PTT_and_Indication (IC1.4)
SWD.NRST: MCU (C10.2 U3.14), JTAG_Connector (X12.15)